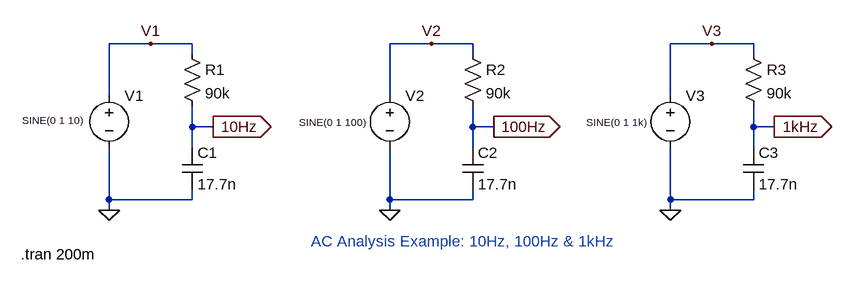
[diagram p0: schematic AC Analysis on RC Filter.asc]
AC Analysis on RC Filter.asc, the LTspice schematic file:
Version 4
SHEET 1 1564 680
WIRE 464 192 400 192
WIRE 528 192 464 192
WIRE 896 192 832 192
WIRE 960 192 896 192
WIRE 1328 192 1264 192
WIRE 1392 192 1328 192
WIRE 528 208 528 192
WIRE 960 208 960 192
WIRE 1392 208 1392 192
WIRE 400 272 400 192
WIRE 832 272 832 192
WIRE 1264 272 1264 192
WIRE 528 320 528 288
WIRE 560 320 528 320
WIRE 960 320 960 288
WIRE 992 320 960 320
WIRE 1392 320 1392 288
WIRE 1424 320 1392 320
WIRE 528 352 528 320
WIRE 960 352 960 320
WIRE 1392 352 1392 320
WIRE 400 432 400 352
WIRE 528 432 528 416
WIRE 528 432 400 432
WIRE 832 432 832 352
WIRE 960 432 960 416
WIRE 960 432 832 432
WIRE 1264 432 1264 352
WIRE 1392 432 1392 416
WIRE 1392 432 1264 432
WIRE 400 448 400 432
WIRE 832 448 832 432
WIRE 1264 448 1264 432
FLAG 400 448 0
FLAG 560 320 10Hz
IOPIN 560 320 Out
FLAG 464 192 V1
FLAG 832 448 0
FLAG 992 320 100Hz
IOPIN 992 320 Out
FLAG 896 192 V2
FLAG 1264 448 0
FLAG 1424 320 1kHz
IOPIN 1424 320 Out
FLAG 1328 192 V3
SYMBOL voltage 400 256 R0
WINDOW 39 0 0 Left 2
WINDOW 3 -134 54 Left 1
SYMATTR Value SINE(0 1 10)
SYMATTR InstName V1
SYMBOL res 512 192 R0
SYMATTR InstName R1
SYMATTR Value 90k
SYMBOL cap 512 352 R0
SYMATTR InstName C1
SYMATTR Value 17.7n
SYMBOL voltage 832 256 R0
WINDOW 39 0 0 Left 2
WINDOW 3 -140 57 Left 1
WINDOW 123 0 0 Left 0
SYMATTR Value SINE(0 1 100)
SYMATTR InstName V2
SYMBOL res 944 192 R0
SYMATTR InstName R2
SYMATTR Value 90k
SYMBOL cap 944 352 R0
SYMATTR InstName C2
SYMATTR Value 17.7n
SYMBOL voltage 1264 256 R0
WINDOW 39 0 0 Left 2
WINDOW 3 -129 57 Left 1
WINDOW 123 0 0 Left 0
SYMATTR Value SINE(0 1 1k)
SYMATTR InstName V3
SYMBOL res 1376 192 R0
SYMATTR InstName R3
SYMATTR Value 90k
SYMBOL cap 1376 352 R0
SYMATTR InstName C3
SYMATTR Value 17.7n
TEXT 944 496 Center 2 ;AC Analysis Example: 10Hz, 100Hz & 1kHz
TEXT 264 516 Left 2 !.tran 200m

The netlist it stands for:
* AC Analysis on RC Filter.asc
V1 V1 0 SINE(0 1 10)
R1 V1 10Hz 90k
C1 10Hz 0 17.7n
V2 V2 0 SINE(0 1 100)
R2 V2 100Hz 90k
C2 100Hz 0 17.7n
V3 V3 0 SINE(0 1 1k)
R3 V3 1kHz 90k
C3 1kHz 0 17.7n
* AC Analysis Example: 10Hz, 100Hz & 1kHz
.tran 200m
.backanno
.end